# EAGLE design W076B (EAGLE 6.6.0)
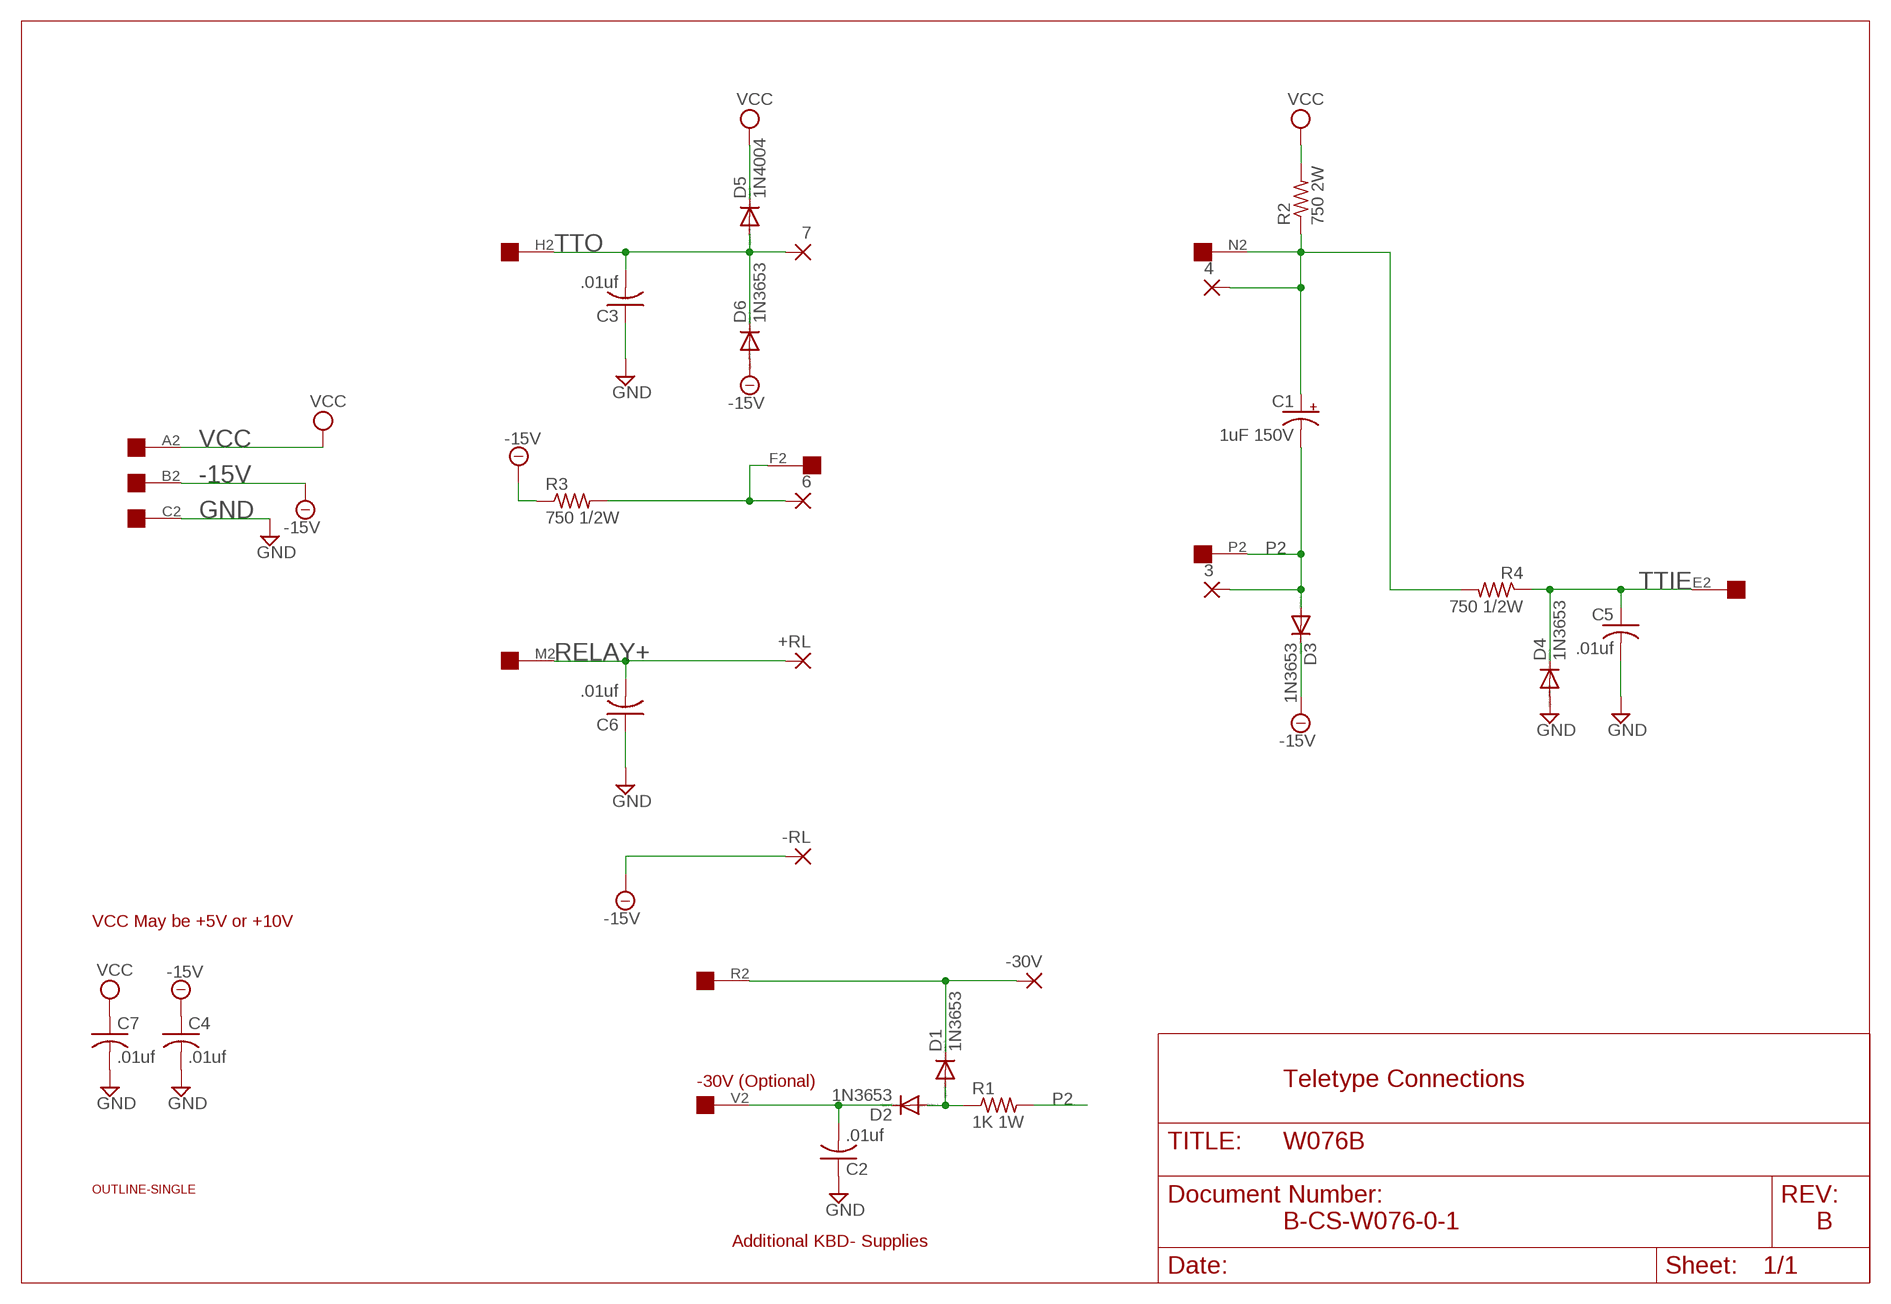
[diagram p0: schematic, sheet 1]

## Parts
3  2,54/1,0  [2,54/1,0]
4  2,54/1,0  [2,54/1,0]
6  2,54/1,0  [2,54/1,0]
7  2,54/1,0  [2,54/1,0]
+RL  2,54/1,0  [2,54/1,0]
-30V  2,54/1,0  [2,54/1,0]
-RL  2,54/1,0  [2,54/1,0]
C1  1uF 150V  CPOL-USE25-9AXIAL  [E25-9]
C2  .01uf  C-US050-025X075  [C050-025X075]
C3  .01uf  C-US050-025X075  [C050-025X075]
C4  .01uf  C-US050-025X075  [C050-025X075]
C5  .01uf  C-US050-025X075  [C050-025X075]
C6  .01uf  C-US050-025X075  [C050-025X075]
C7  .01uf  C-US050-025X075  [C050-025X075]
D1  1N3653  1N4148DO35-10  [DO35-10]
D2  1N3653  1N4148DO35-10  [DO35-10]
D3  1N3653  1N4148DO35-10  [DO35-10]
D4  1N3653  1N4148DO35-10  [DO35-10]
D5  1N4004  1N4148DO35-10  [DO35-10]
D6  1N3653  1N4148DO35-10  [DO35-10]
EDGE  EDGE-1  [EDGE-CON1]
R1  1K 1W  R-US_0617/22  [0617/22]
R2  750 2W  R-US_0817/22  [P0817/22]
R3  750 1/2W  R-US_0411/15  [0411/15]
R4  750 1/2W  R-US_0411/15  [0411/15]
U$1  OUTLINE-SINGLE  [SINGLE]

## Nets
-15V: -RL.1(P) C4.1 D3.C D6.A EDGE.B2 R3.1
GND: C2.1 C3.1 C4.2 C5.2 C6.1 C7.2 D4.A EDGE.C2
N$1: 6.1(P) EDGE.F2 R3.2
N$3: -30V.1(P) D1.C EDGE.R2
N$5: C2.2 D2.C EDGE.V2
N$6: D1.A D2.A R1.1
N$7: 4.1(P) C1.+ EDGE.N2 R2.1 R4.2
P2: 3.1(P) C1.- D3.A EDGE.P2 R1.2
RELAY+: +RL.1(P) C6.2 EDGE.M2
TTIE: C5.1 D4.C EDGE.E2 R4.1
TTO: 7.1(P) C3.2 D5.A D6.C EDGE.H2
VCC: C7.1 D5.C EDGE.A2 R2.2
Unconnected: EDGE.D2 EDGE.J2 EDGE.K2 EDGE.L2 EDGE.S2 EDGE.T2 EDGE.U2

## Notes on the sheet
- VCC May be +5V or +10V
- -30V (Optional) | Teletype Connections
- B-CS-W076-0-1 | B
- Additional KBD- Supplies

## Library data of the parts
3 4 6 7 +RL -30V -RL = wirepad:2,54/1,0: THROUGH-HOLE PAD
C1 = rcl:CPOL-US: POLARIZED CAPACITOR, American symbol
C2-C7 = rcl:C-US: CAPACITOR, American symbol
D1-D6 = diode:1N4148: DIODE high speed (Philips)
EDGE = dec-con:EDGE-1: Single-Sided DEC Edge Connector -- (side 2)
R1-R4 = rcl:R-US_: RESISTOR, American symbol
U$1 = dec-con:OUTLINE-*: Board outlines for DEC boards.

## Board
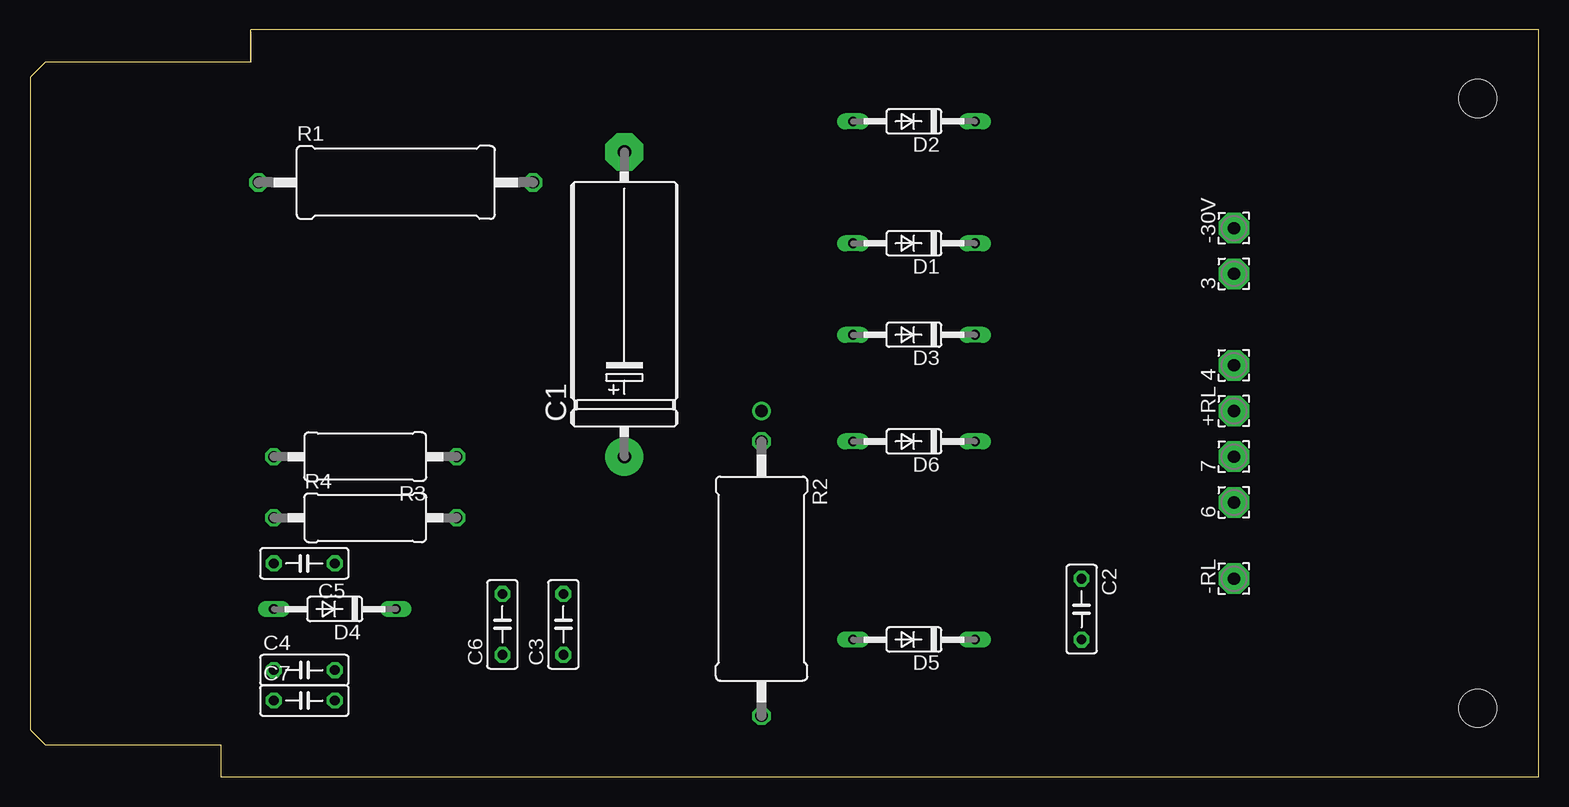
[diagram p1: board, top side]
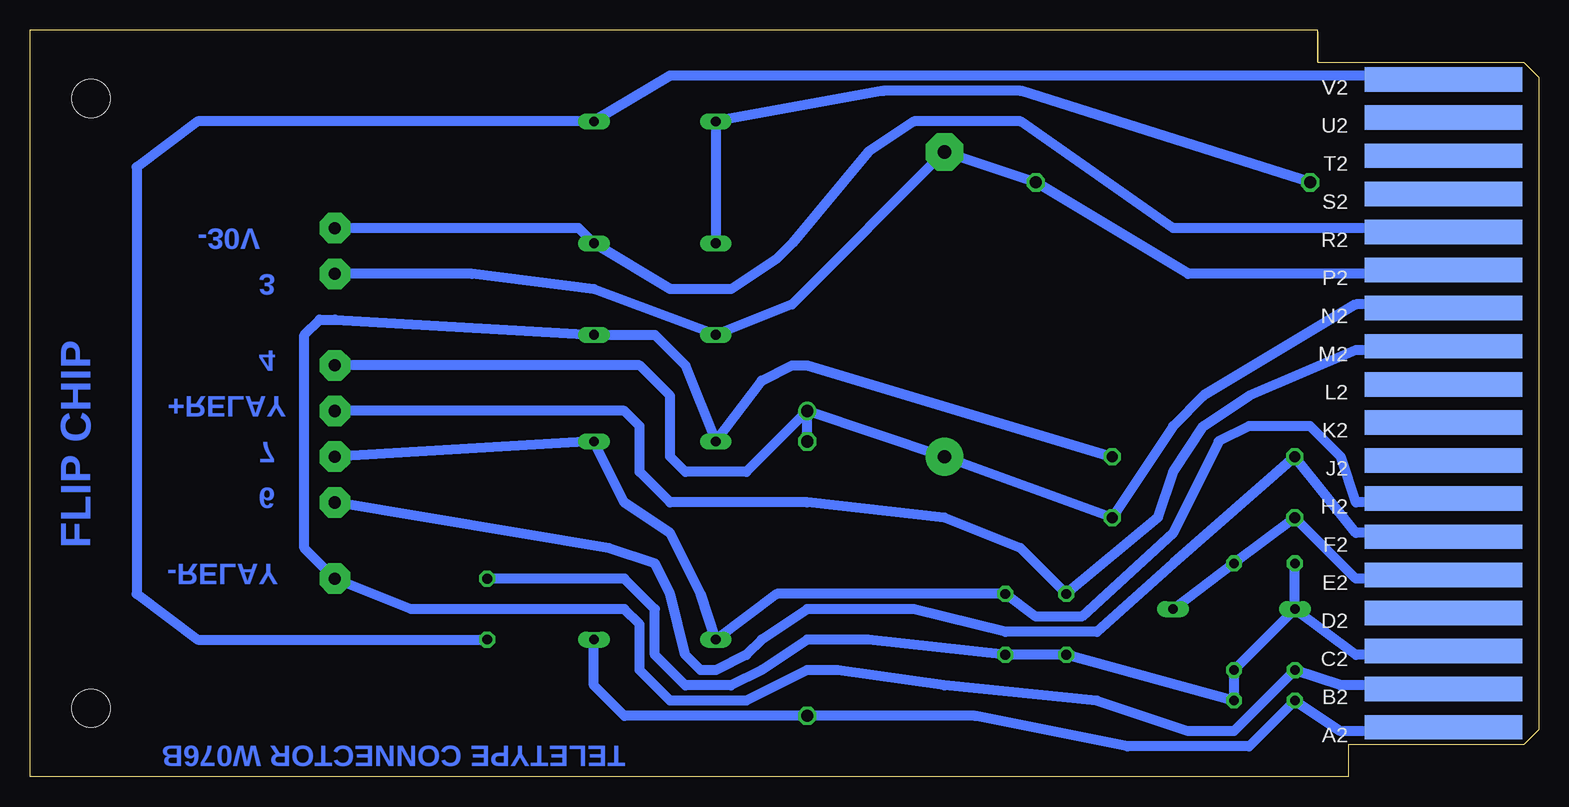
[diagram p2: board, bottom side, seen from below]

Size 125.73 x 62.23 mm. Coordinates in mm from the lower left corner, seen from the top.
Copper layers (1+16): Top 0.035mm / dielectric 1.5mm / Bottom 0.035mm
Design rules "16mils": minimum track width 16mil, minimum drill 32mil, track to track 15mil, track to pad 10mil, pad to pad 10mil, via to via 10mil, smd to smd 10mil, copper to edge 13mil, drill to drill 10mil, minimum pad ring 10mil, minimum via ring 8mil, stop-mask expansion 0mil, vias tented up to drill 0mil, thermal gap 10mil

### Footprints (pad centres in the part's own frame; a part is rotated, then mirrored left to right if it is on the bottom)
2,54/1,0 = drill 1.016 pad 2.54 octagon: 1 0,0
E25-9 = drill 1.118 pad 3.15: + -12.7,0 | drill 1.118 pad 3.15 octagon: - 12.7,0
C050-025X075 = drill 0.813 octagon: 1 -2.54,0; 2 2.54,0
DO35-10 = drill 0.813 long: A 5.08,0; C -5.08,0
EDGE-CON1 = smd 13.106 x 2.032 bottom: A2 7.938,4.128; B2 7.938,7.303; C2 7.938,10.477; D2 7.938,13.652; E2 7.938,16.828; F2 7.938,20.003; H2 7.938,23.177; J2 7.938,26.352; K2 7.938,29.527; L2 7.938,32.703; M2 7.938,35.877; N2 7.938,39.053; P2 7.938,42.227; R2 7.938,45.403; S2 7.938,48.578; T2 7.938,51.752; U2 7.938,54.928; V2 7.938,58.102
0617/22 = drill 1.016 octagon: 1 -11.43,0; 2 11.43,0
P0817/22 = drill 1.016 octagon: 1 -11.43,0; 2 11.43,0
0411/15 = drill 0.914 octagon: 1 -7.62,0; 2 7.62,0
SINGLE = hole 3.175: 120.65,56.515; 120.65,5.715

### Placement (x,y rotation side)
3  100.33,41.91 90 top
4  100.33,34.29 90 top
6  100.33,22.86 90 top
7  100.33,26.67 90 top
+RL  100.33,30.48 90 top
-30V  100.33,45.72 90 top
-RL  100.33,16.51 90 top
C1  49.53,39.37 90 top
C2  87.63,13.97 270 top
C3  44.45,12.7 90 top
C4  22.86,8.89 0 top
C5  22.86,17.78 180 top
C6  39.37,12.7 90 top
C7  22.86,6.35 0 top
D1  73.66,44.45 180 top
D2  73.66,54.61 180 top
D3  73.66,36.83 180 top
D4  25.4,13.97 180 top
D5  73.66,11.43 180 top
D6  73.66,27.94 180 top
EDGE  0,0 0 top
R1  30.48,49.53 0 top
R2  60.96,16.51 270 top
R3  27.94,26.67 180 top
R4  27.94,21.59 0 top
U$1  0,0 0 top
U$2  [FLIPCHIP]  125.73,0 0 bottom

### Tracks (layer width: path | path; a pad name or v marks a point on that pad's centre or on a via)
-15V
  Bottom 0.813: EDGE.B2 8.89,7.62 16.51,7.62 C4.1 25.4,3.81 29.21,3.81 36.83,6.35 49.53,7.62 58.42,8.89 60.96,8.89 66.04,6.35 72.39,6.35 74.93,8.89 74.93,12.7 76.2,13.97 93.98,13.97 -RL.1 102.87,19.05 102.87,36.83 101.6,38.1 100.33,38.1 D3.C 73.66,36.83 71.12,34.29 D6.A 64.77,33.02 62.23,34.29 60.96,34.29 R3.1
GND
  Bottom 0.813: EDGE.C2 8.89,10.16 15.24,10.16 D4.A | D4.A C5.2 | D4.A C4.2 C7.2 C6.1 C3.1 55.88,11.43 60.96,11.43 64.77,8.89 67.31,7.62 71.12,7.62 73.66,10.16 73.66,13.97 76.2,16.51 C2.1
N$1
  Bottom 0.813: EDGE.F2 8.89,20.32 15.24,20.32 R3.2 30.48,17.78 36.83,12.06 44.45,12.06 52.07,13.97 60.96,13.97 64.77,11.43 66.04,10.16 68.58,8.89 69.85,8.89 71.12,10.16 72.39,15.24 73.66,17.78 77.47,19.05 6.1
N$3
  Bottom 0.813: EDGE.R2 8.89,45.72 30.48,45.72 43.18,54.61 52.07,54.61 55.88,52.07 62.23,44.45 63.5,43.18 67.31,40.64 72.39,40.64 D1.C 80.01,45.72 -30V.1
N$5
  Bottom 0.813: EDGE.V2 8.89,58.42 72.39,58.42 D2.C 111.76,54.61 116.84,50.8 116.84,15.24 111.76,11.43 C2.2
N$6
  Bottom 0.813: R1.1 43.18,57.15 54.61,57.15 D2.A D1.A
N$7  (via drill 1.02)
  Bottom 0.813: EDGE.N2 8.89,39.37 15.24,39.37 27.94,31.75 30.48,29.21 R4.2 C1.+ v60.96,30.48 | R2.1 v60.96,30.48 | v60.96,30.48 66.04,25.4 71.12,25.4 72.39,26.67 72.39,31.75 74.93,34.29 4.1
P2
  Bottom 0.813: EDGE.P2 8.89,41.91 29.21,41.91 R1.2 C1.- 62.23,39.37 D3.A 78.74,40.64 88.9,41.91 3.1
RELAY+
  Bottom 0.813: EDGE.M2 8.89,35.56 15.24,35.56 24.13,31.75 27.94,29.21 30.48,25.4 31.75,21.59 C6.2 43.18,19.05 49.53,21.59 60.96,22.86 72.39,22.86 74.93,25.4 74.93,29.21 76.2,30.48 +RL.1
TTIE
  Bottom 0.813: EDGE.E2 8.89,16.51 15.24,16.51 R4.1 C5.1 D4.C
TTO
  Bottom 0.813: EDGE.H2 8.89,22.86 15.24,22.86 16.51,26.67 19.05,29.21 24.13,29.21 26.67,27.94 30.48,20.32 38.1,13.34 41.91,13.34 C3.2 63.5,15.24 D5.A 69.85,15.24 72.39,20.32 76.2,22.86 D6.C 7.1
VCC
  Bottom 0.813: EDGE.A2 8.89,3.81 16.51,3.81 C7.1 24.13,2.54 34.29,2.54 46.99,5.08 R2.2 76.2,5.08 78.74,7.62 D5.C

### Text on the board
Bottom: -30V | 3 | 4 | +RELAY | 7 | 6 | -RELAY | TELETYPE CONNECTOR W076B
200bmp: C:/Users/Vince/Documents/websvn/trunk/Eagle/projects/DEC/Wxxx/W076/W076Bbackfb.bmp